# Altium schematic sheet User Interface.SchDoc: User Interface
size A4; Date: 2016/01/05; Author: Samuel López; DocumentNumber: 6; SheetNumber: 6; SheetTotal: 7; Project: H2H Main Board
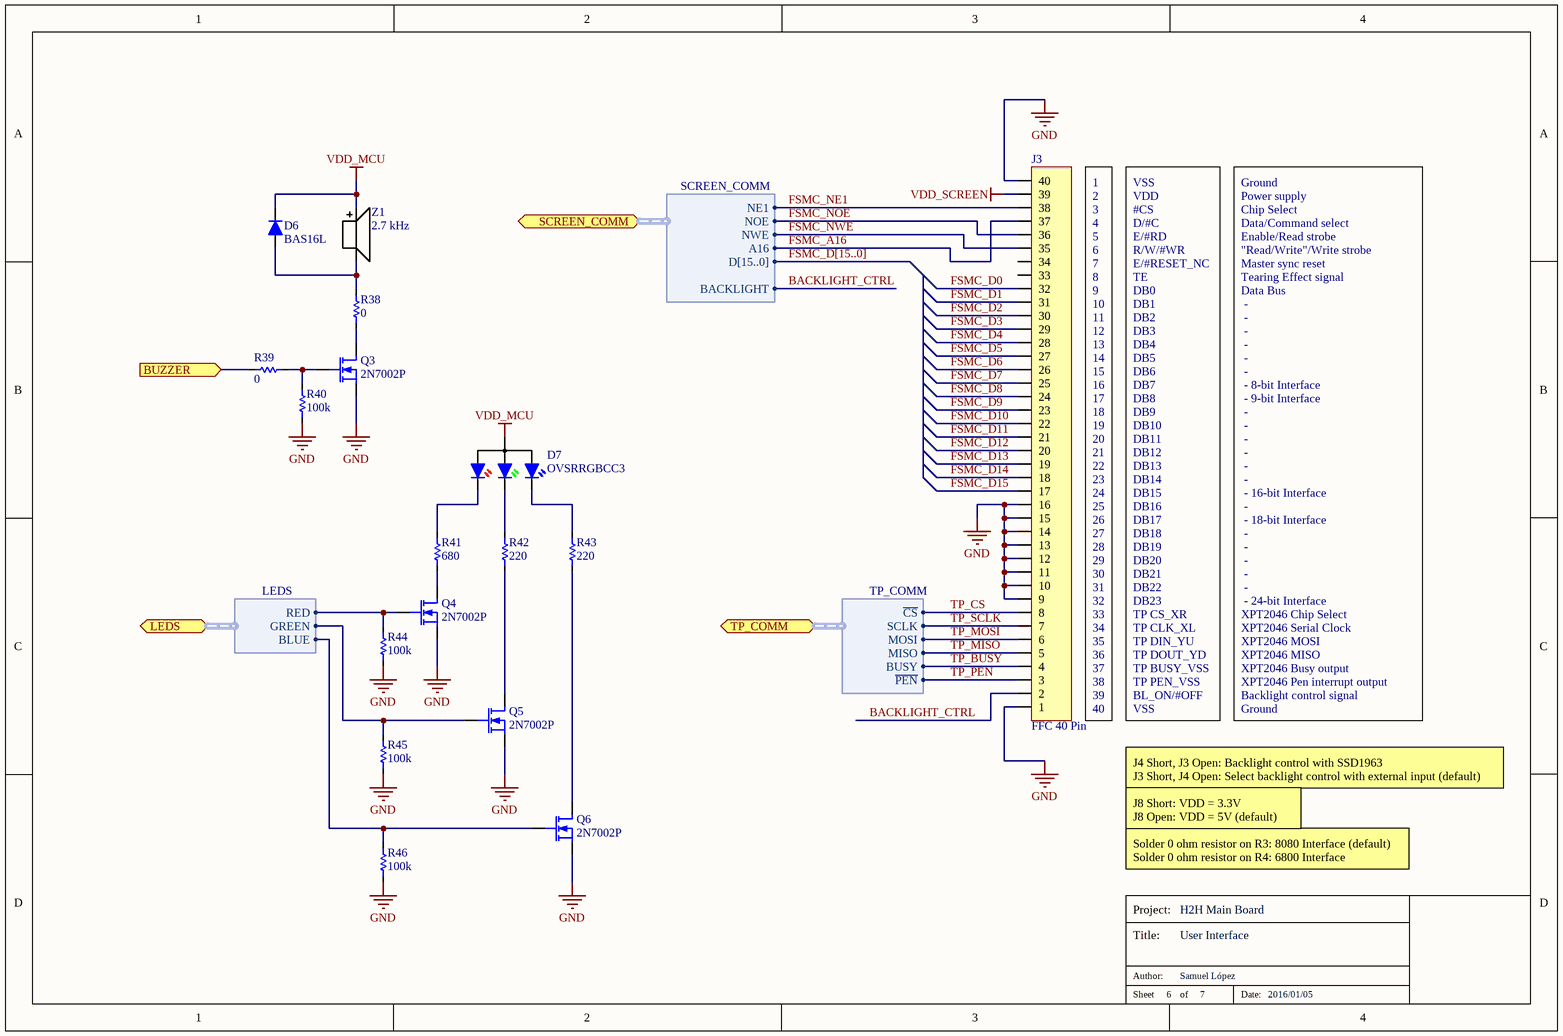
[diagram p0: User Interface.SchDoc]

## Parts
D6  BAS16L  [BAS16L]
D7  OVSRRGBCC3  [OVSRRGBCC3/SIDE]
J3  FFC 40 Pin  [ER-CON40HB-2]
Q3  2N7002P  [2N7002P]
Q4  2N7002P  [2N7002P]
Q5  2N7002P  [2N7002P]
Q6  2N7002P  [2N7002P]
R38  0  [R0603]
R39  0  [R0603]
R40  100k  [R0603]
R41  680  [R0603]
R42  220  [R0603]
R43  220  [R0603]
R44  100k  [R0603]
R45  100k  [R0603]
R46  100k  [R0603]
Z1  2.7 kHz  [KSSG74B16]

## Ports
BUZZER (in), LEDS (harness LEDS), SCREEN_COMM (harness SCREEN_COMM), TP_COMM (harness TP_COMM)

## Harnesses
SCREEN_COMM: NE1, NOE, NWE, A16, D[15..0], BACKLIGHT
TP_COMM: ~{CS}, SCLK, MOSI, MISO, BUSY, ~{PEN}
LEDS: RED, GREEN, BLUE

## Nets
GND: J3.1 J3.9 J3.10 J3.11 J3.12 J3.13 J3.14 J3.15 J3.16 J3.40 Q3.2(S) Q4.2(S) Q5.2(S) Q6.2(S) R40.2 R44.2 R45.2 R46.2
VDD_MCU: D6.3(K) D7.4(A) Z1.1(+)
VDD_SCREEN: J3.39
BACKLIGHT_CTRL: J3.2 ; port SCREEN_COMM.BACKLIGHT
BUZZER: R39.1 ; port BUZZER
FSMC_A16: J3.37 ; port SCREEN_COMM.A16
FSMC_D0: J3.32
FSMC_D1: J3.31
FSMC_D2: J3.30
FSMC_D3: J3.29
FSMC_D4: J3.28
FSMC_D5: J3.27
FSMC_D6: J3.26
FSMC_D7: J3.25
FSMC_D8: J3.24
FSMC_D9: J3.23
FSMC_D10: J3.22
FSMC_D11: J3.21
FSMC_D12: J3.20
FSMC_D13: J3.19
FSMC_D14: J3.18
FSMC_D15: J3.17
FSMC_NE1: J3.38 ; port SCREEN_COMM.NE1
FSMC_NOE: J3.36 ; port SCREEN_COMM.NOE
FSMC_NWE: J3.35 ; port SCREEN_COMM.NWE
TP_BUSY: J3.4 ; port TP_COMM.BUSY
TP_CS: J3.8 ; port TP_COMM.~{CS}
TP_MISO: J3.5 ; port TP_COMM.MISO
TP_MOSI: J3.6 ; port TP_COMM.MOSI
TP_PEN: J3.3 ; port TP_COMM.~{PEN}
TP_SCLK: J3.7 ; port TP_COMM.SCLK
NetD6_1: D6.1(A) R38.1 Z1.2(-)
NetD7_1: D7.1(K_R) R41.2
NetD7_2: D7.2(K_G) R42.1
NetD7_3: D7.3(K_B) R43.2
NetQ3_1: Q3.1(G) R39.2 R40.1
NetQ3_3: Q3.3(D) R38.2
NetQ4_1: Q4.1(G) R44.1 ; port LEDS.RED
NetQ4_3: Q4.3(D) R41.1
NetQ5_1: Q5.1(G) R45.1 ; port LEDS.GREEN
NetQ5_3: Q5.3(D) R42.2
NetQ6_1: Q6.1(G) R46.1 ; port LEDS.BLUE
NetQ6_3: Q6.3(D) R43.1

Not connected (* = marked no-connect by the designer): J3 33 34

## Buses and harness runs
bus FSMC_D[15..0]

## Notes on the sheet
- 1
  2
  3
  4
  5
  6
  7
  8
  9
  10
  11
  12
  13
  14
  15
  16
  17
  18
  19
  20
  21
  22
  23
  24
  25
  26
  27
  28
  29
  30
  31
  32
  33
  34
  35
  36
  37
  38
  39
  40
- VSS
  VDD
  #CS
  D/#C
  E/#RD
  R/W/#WR
  E/#RESET_NC
  TE
  DB0
  DB1
  DB2
  DB3
  DB4
  DB5
  DB6
  DB7
  DB8
  DB9
  DB10
  DB11
  DB12
  DB13
  DB14
  DB15
  DB16
  DB17
  DB18
  DB19
  DB20
  DB21
  DB22
  DB23
  TP CS_XR
  TP CLK_XL
  TP DIN_YU
  TP DOUT_YD
  TP BUSY_VSS
  TP PEN_VSS
  BL_ON/#OFF
  VSS
- Ground
  Power supply
  Chip Select
  Data/Command select
  Enable/Read strobe
  "Read/Write"/Write strobe
  Master sync reset
  Tearing Effect signal
  Data Bus
  -
  -
  -
  -
  -
  -
  - 8-bit Interface
  - 9-bit Interface
  -
  -
  -
  -
  -
  -
  - 16-bit Interface
  -
  - 18-bit Interface
  -
  -
  -
  -
  -
  - 24-bit Interface
  XPT2046 Chip Select
  XPT2046 Serial Clock
  XPT2046 MOSI
  XPT2046 MISO
  XPT2046 Busy output
  XPT2046 Pen interrupt output
  Backlight control signal
  Ground
- J4 Short, J3 Open: Backlight control with SSD1963
  J3 Short, J4 Open: Select backlight control with external input (default)
- J8 Short: VDD = 3.3V
  J8 Open: VDD = 5V (default)
- Solder 0 ohm resistor on R3: 8080 Interface (default)
  Solder 0 ohm resistor on R4: 6800 Interface
- Project:
- Title:
- Sheet
- Author:
- of
- Date:

## Library data of the parts
D6 = BAS16L: Diode - Switching diode, 1 V, 200 mA; Supplier 1: Digi-Key; Supplier Part Number 1: BAS16LT1GOSCT-ND
D7 = OVSRRGBCC3: LED - RGB, Top/Side-emmiting; Supplier 1: Digi-Key; Supplier Part Number 1: 365-1981-1-ND
J3 = ER-CON40HB-2: Conn - FFC/FPC, 40 Pin, 1.0mm Pitch, ZIF
Q3-Q6 = 2N7002P: Transistor - MOSFET, N-Channel, 60V, 300mA; Supplier 1: Digi-Key; Supplier Part Number 1: 568-5818-1-ND
R38-R46 = Resistor: Power: *
  R38 R39: Value: 0
  R40 R44-R46: Value: 100k
  R41: Value: 680
  R42 R43: Value: 220
Z1 = KSSG74B16: Transductor - Buzzer 2.7 kHz; Supplier 1: Farnell; Supplier Part Number 1: 2215090; Resonant frequency: 2.7 kHz